# Altium schematic sheet Ethernet_1.SchDoc
size A3; SheetNumber: 4; SheetTotal: 6
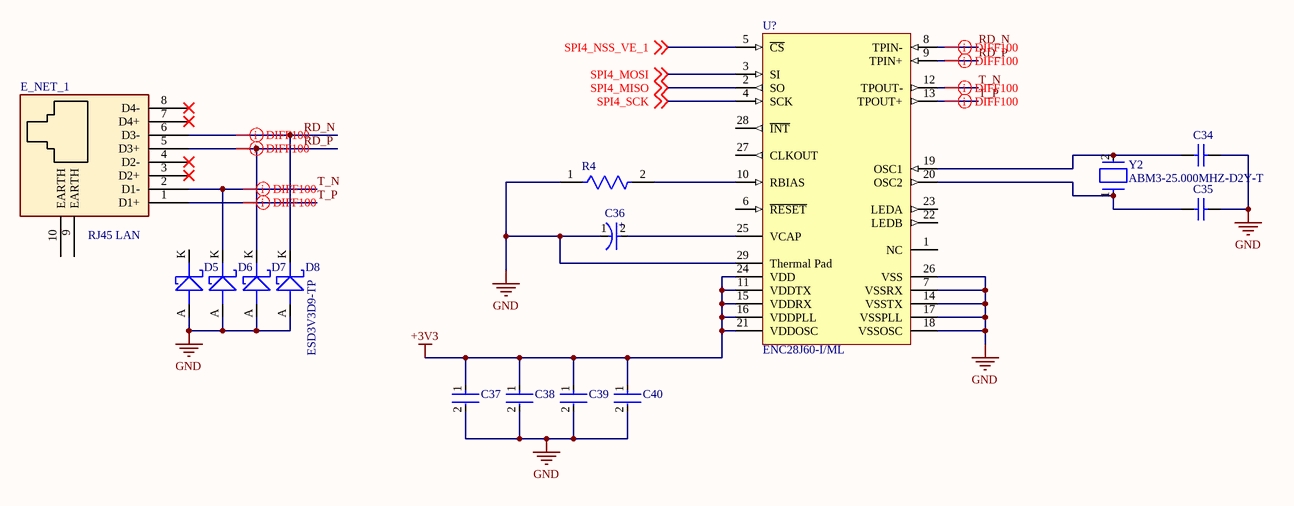
[diagram p0: Ethernet_1.SchDoc]

## Parts
C34  CC0603JRNPO9BN180  [CAPC1608X90X40LL10T20]  (value not drawn)
C35  CC0603JRNPO9BN180  [CAPC1608X90X40LL10T20]  (value not drawn)
C36  593D106X9016A2TE3  [FP-593DA-MFG]  (value not drawn)
C37  C0402C104K8RACTU  [FP-C0402-BB-MFG]  (value not drawn)
C38  C0402C104K8RACTU  [FP-C0402-BB-MFG]  (value not drawn)
C39  C0402C104K8RACTU  [FP-C0402-BB-MFG]  (value not drawn)
C40  C0402C104K8RACTU  [FP-C0402-BB-MFG]  (value not drawn)
D5  ESD3V3D9-TP  [DIO_SOD-923]  (value not drawn)
D6  ESD3V3D9-TP  [DIO_SOD-923]  (value not drawn)
D7  ESD3V3D9-TP  [DIO_SOD-923]
D8  ESD3V3D9-TP  [DIO_SOD-923]  (value not drawn)
E_NET_1  RJ45 LAN  [CON10_P106_RJ45_TH_ST]
R4  ERJ-2RKF2001X  [FP-ERJ2RK-MFG]  (value not drawn)
U?  ENC28J60-I/ML  [QFN-ML28_M]
Y2  ABM3-25.000MHZ-D2Y-T  [FP-ABM3-MFG]

## Nets
+3V3: C37.1 C38.1 C39.1 C40.1 U?.11(VDDTX) U?.15(VDDRX) U?.16(VDDPLL) U?.21(VDDOSC) U?.24(VDD)
GND: C34.1 C35.1 C36.1(C) C37.2 C38.2 C39.2 C40.2 D5.A D6.A D7.A D8.A R4.1 U?.7(VSSRX) U?.14(VSSTX) U?.17(VSSPLL) U?.18(VSSOSC) U?.26(VSS) U?.29(Thermal_Pad)
RD_N: D8.K E_NET_1.6(D3-) U?.8(TPIN-)
RD_P: D7.K E_NET_1.5(D3+) U?.9(TPIN+)
SPI4_MISO: U?.2(SO) ; off-sheet SPI4_MISO
SPI4_MOSI: U?.3(SI) ; off-sheet SPI4_MOSI
SPI4_NSS_VE_1: U?.5(~{CS}) ; off-sheet SPI4_NSS_VE_1
SPI4_SCK: U?.4(SCK) ; off-sheet SPI4_SCK
T_N: D6.K E_NET_1.2(D1-) U?.12(TPOUT-)
T_P: E_NET_1.1(D1+) U?.13(TPOUT+)
NetC34_2: C34.2 U?.19(OSC1) Y2.2
NetC35_2: C35.2 U?.20(OSC2) Y2.1
NetC36_2: C36.2(A) U?.25(VCAP)
NetR4_2: R4.2 U?.10(RBIAS)

Not connected (* = marked no-connect by the designer): D5 K; E_NET_1 3(D2+)* 4(D2-)* 7(D4+)* 8(D4-)* 9(EARTH) 10(EARTH); U? 1(NC) 6(~{RESET}) 22(LEDB) 23(LEDA) 27(CLKOUT) 28(~{INT})

## Layout directives
differential pair; differential pair class DIFF100; rule Differential Pairs Routing [Pref Gap = 8mil    Min Gap  = 8mil    Max Gap  = 8milPref Width = 10mil    Min Width  = 10mil    Max Width  = 10mil]: RD_N, RD_P, T_N, T_P

## Notes on the sheet
- (in symbol CMP-00030-39455466-1) +

## Library data of the parts
C34 C35 = CMP-1659-00030-1: Chip Capacitor, 18 pF, +/- 5%, 50 V, -55 to 125 degC, 0603 (1608 Metric), RoHS, Tape and Reel; Voltage Rating: 50 V; Case\Package: 0603; Power Rating: 100 mW; Resistance: 68.1 Ohm; Tolerance: 1%; Case Code (Metric): 1608; Max Operating Temperature: 155 degC; RoHSCompliant: true; Case Code (Imperial): 0603; ComponentLink2Description: Datasheet; Package Quantity: 200; PackageReference: 0603; ComponentLink2URL: http://www.yageo.com/NewPortal/yageodocoutput?fileName=/pdf/MLCC/UPY-GP_NP0_16V-to-50V_14.pdf; Length: 1.6 mm; DatasheetVersion: Rev. 14, 07/2016; Min Operating Temperature: -55 degC; ComponentLink1URL: http://www.yageo.com/; Width: 0.8 mm; ComponentLink1Description: Manufacturer URL; Height: 0.45 mm; Radiation Hardening: No; PackageDescription: 2-Pin Surface Mount Device, Body 1.6 x 0.8 mm; Packaging: Tape and Reel
C36 = CMP-00030-39455466-1: 593D106X9016A2TE3 Cap Tant Solid 10uF 16V A CASE 10% (3.2 X 1.6 X 1.6mm) SMD 3216-18 1.7 Ohm 125C T/R; ESR (Equivalent Series Resistance): 1.7Ω; Polarity: Polar; Dissipation Factor: 6%; Ripple Current: 210µA; Capacitance: 10µF; Leakage Current: 1.6µA; Tolerance: 10%; Max Operating Temperature: 125°C; Voltage: 16V; Width: 1.6mm; Schedule B: 8532210050, 8532210050; Voltage Rating: 16V; NexarPartId: 39455466; REACH SVHC: Unknown; Length: 3.2mm; RoHS: Compliant; Case/Package: 1206; Height: 1.6mm; Termination: SMD/SMT; Depth: 1.6mm; Lead Free: Lead Free; Case Code (Imperial): 1206; Packaging: Cut Tape; Case Code (Metric): 3216; Voltage Rating (DC): 16V; Height - Seated (Max): 1.8034mm; Radiation Hardening: No; Features: General Purpose; Mount: PCB, Surface Mount; Min Operating Temperature: -55°C
C37-C40 = CMP-2008-03086-2: CAP CER 0.1UF 10V X7R 0402; Manufacturer: Kemet; Capacitance: 0.10 μF; Tolerance: 0.1; Temperature Coefficient: 15%; Value: 0.10 μF; Material: Ceramic; Automotive: No; Temperature Range High: +125°C; Octopart: https://octopart.com/c0402c104k8ractu-kemet-106349; ComponentLink2Description: Datasheet; ComponentLink2URL: https://content.kemet.com/datasheets/KEM_C1002_X7R_SMD.pdf; Temperature: -55°C to +125°C; RoHS: TRUE; Temperature Range Low: -55°C; Temperature Characteristic: X7R; Lead Free: Yes; Height: 0.55mm; Manufacturer Part Number: C0402C104K8RACTU; Voltage Rating: 10 V; Category: Cap; Device Class L3: Ceramic Capacitors; Digikey Description: CAP CER 0.1UF 10V X7R 0402; Package: C0402-BB; Device Class L1: Passive Components; Ipc Land Pattern Name: CAPC10050X50; Mouser Description: Multilayer Ceramic Capacitors MLCC - SMD/SMT 10volts 0.1uF X7R 10%; Device Class L2: Capacitors
D5-D8 = DIO-T_3.3V-8.8V-SOD923: 8.8V Clamp 5A (8/20µs) Ipp Tvs Diode Surface Mount SOD-923; Manufacturer: Micro Commercial Co; Alternate Part Number-1: NA; Manufacturer Part Number: ESD3V3D9-TP; Case/Package: SOD923; Supplier-1: Digikey; Supplier Part Number-1: ESD3V3D9-TPMSCT-ND - Cut Tape (CT)
E_NET_1 = CON-SKT-RJ_8C8P-RA-TH: 8 Pins, 2 Row 2.54mm Pitch, right angle Connector, male; Manufacturer: Assmann; Manufacturer Part Number: A-2004-2-4-LPS-N-R; Alternate Part Number-1: NA; Case/Package: TH-CON; Supplier-1: SP ROAD; Supplier Part Number-1: A-2004-2-4-LPS-N-R
R4 = CMP-2002-00758-4: RES SMD 2K OHM 1% 1/10W 0402; Temperature Coefficient: 100ppm/°C; Max Power Dissipation: 100mW; Working Voltage: 50V; Resistance: 2kR; Number of Terminations: 2; Technology: THICK FILM; Packaging: Tape and Reel; RoHS Compliant: Yes; Min Operating Temperature: -55°C; Length: 1mm; Construction: Rectangular; Features: Automotive AEC-Q200; Contact Plating: Tin; Lead Free: Lead Free; Series: ERJ; Power Rating: 100mW; REACH SVHC: No SVHC; Resistor Type: Thick Film; Max Operating Temperature: 155°C; Package Quantity: 10000; Height: 0.35mm; Case/Package: 0402; Tolerance: 1%; Mount: Surface Mount; Termination: SMD/SMT; Resistance Tolerance: 1%; Depth: 0.5mm; Voltage Rating (DC): 50V; Voltage Rating: 50V; Case Code (Imperial): 0402; Military Standard: Not; Width: 0.02inch; Radiation Hardening: No; Case Code (Metric): 1005
U? = CMP-0186-00028-2: Stand-Alone Ethernet Controller with SPI Interface, 28-Pin QFN, Industrial Temperature; ComponentLink1URL: http://www.microchip.com/; ComponentLink2Description: Datasheet; DatasheetVersion: revC, Jan-2008; ComponentLink1Description: Manufacturer URL; PackageReference: QFN-ML28; ComponentLink3Description: Package Specification; PackageVersion: revBB, Aug-2009; ComponentLink2URL: http://ww1.microchip.com/downloads/en/DeviceDoc/39662c.pdf; ComponentLink3URL: http://www.microchip.com/stellent/groups/techpub_sg/documents/packagingspec/en012702.pdf; RevisionNote: URLs added.; Code_JEDEC: MO-220; PackageDescription: 28-Lead Plastic Quad Flat, No Lead Package (ML) - 6x6 mm Body [QFN] with 0.55 mm Contact Length
Y2 = CMP-27762-002203-1: Crystal 25MHz ±20ppm 18pF SMD-2 5mm x 3.2mm; Series Resistance: 30R; Frequency Stability: 30ppm; Load Capacitance: 18pF; Length: 5mm; Operating Frequency: 25 MHz; Number of Pins: 2; Depth: 3.2mm; Case/Package: CSMD; Packaging: Tape and Reel; Min Operating Temperature: -40°C; Width: 3.2mm; Termination: SMD/SMT; Lead Free: Lead Free; Frequency: 25MHz; Frequency Tolerance: 20ppm; ESR (Equivalent Series Resistance): 30R; Package Quantity: 1000; Max Operating Temperature: 85°C; Height: 0.051inch; Series: ABM3; REACH SVHC: Yes; Mount: Surface Mount; Resistor Type: Ceramic; Tolerance: 20ppm